# Altium project Coral_Dev_Baseboard.PrjPcb (part 3 of 5)

## Sheet 05_AUDIO.SchDoc
size A2; ApprovedBy: DNP; CheckedBy: DNP; Author: DNP; CompanyName: Google LLC; DrawnBy: DNP; Engineer: Bangfei/Michael/Leo; Organization: Google LLC; Address1: 1600 Amphitheatre Parkway; Address2: Mountain View, CA 94043; Address3: DNP; Address4: DNP; DocumentNumber: DNP; Revision: PVT; SheetNumber: 5; SheetTotal: 11; VersionControl_RevNumber: DNP; IsUserConfigurable: DNP; Time: DNP; ImagePath: DNP; Rule: DNP; ProjectName: Enterprise; Application_BuildNumber: DNP
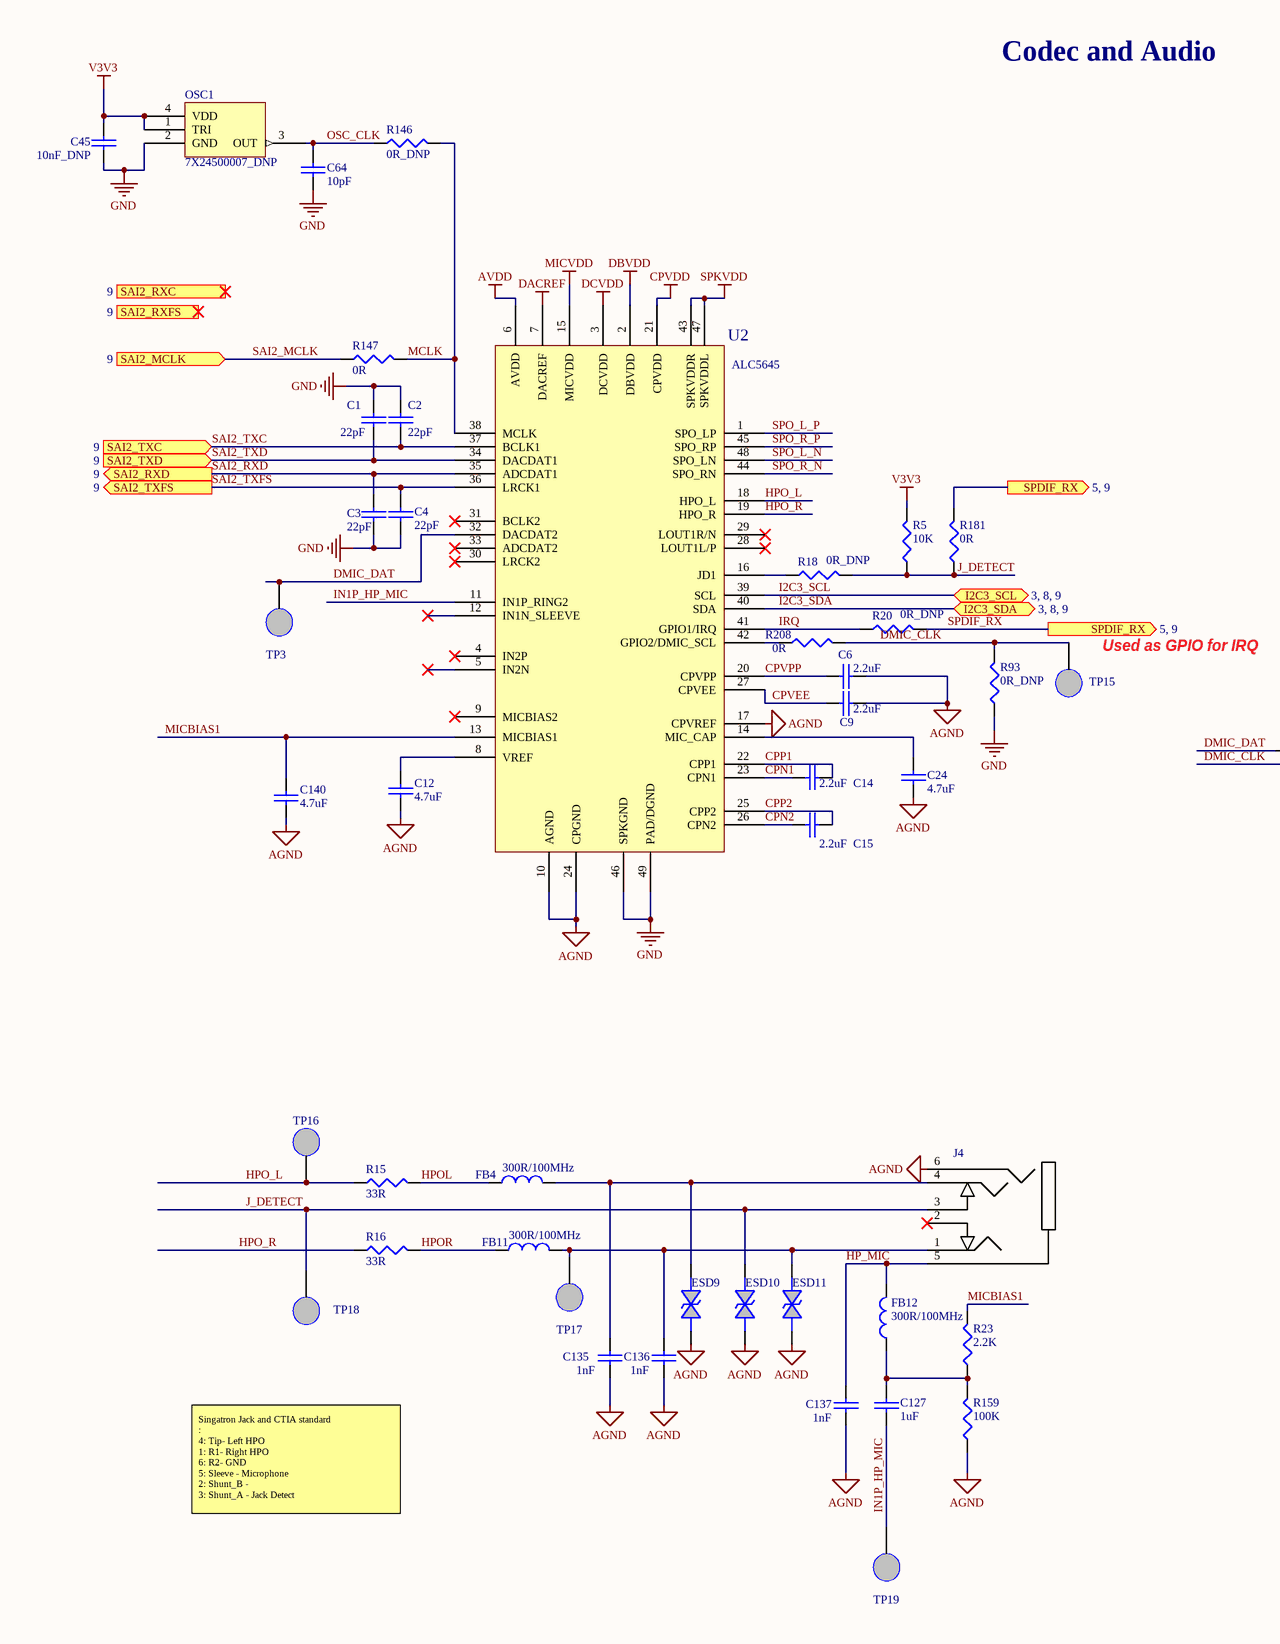
[diagram p6: 05_AUDIO.SchDoc, left]
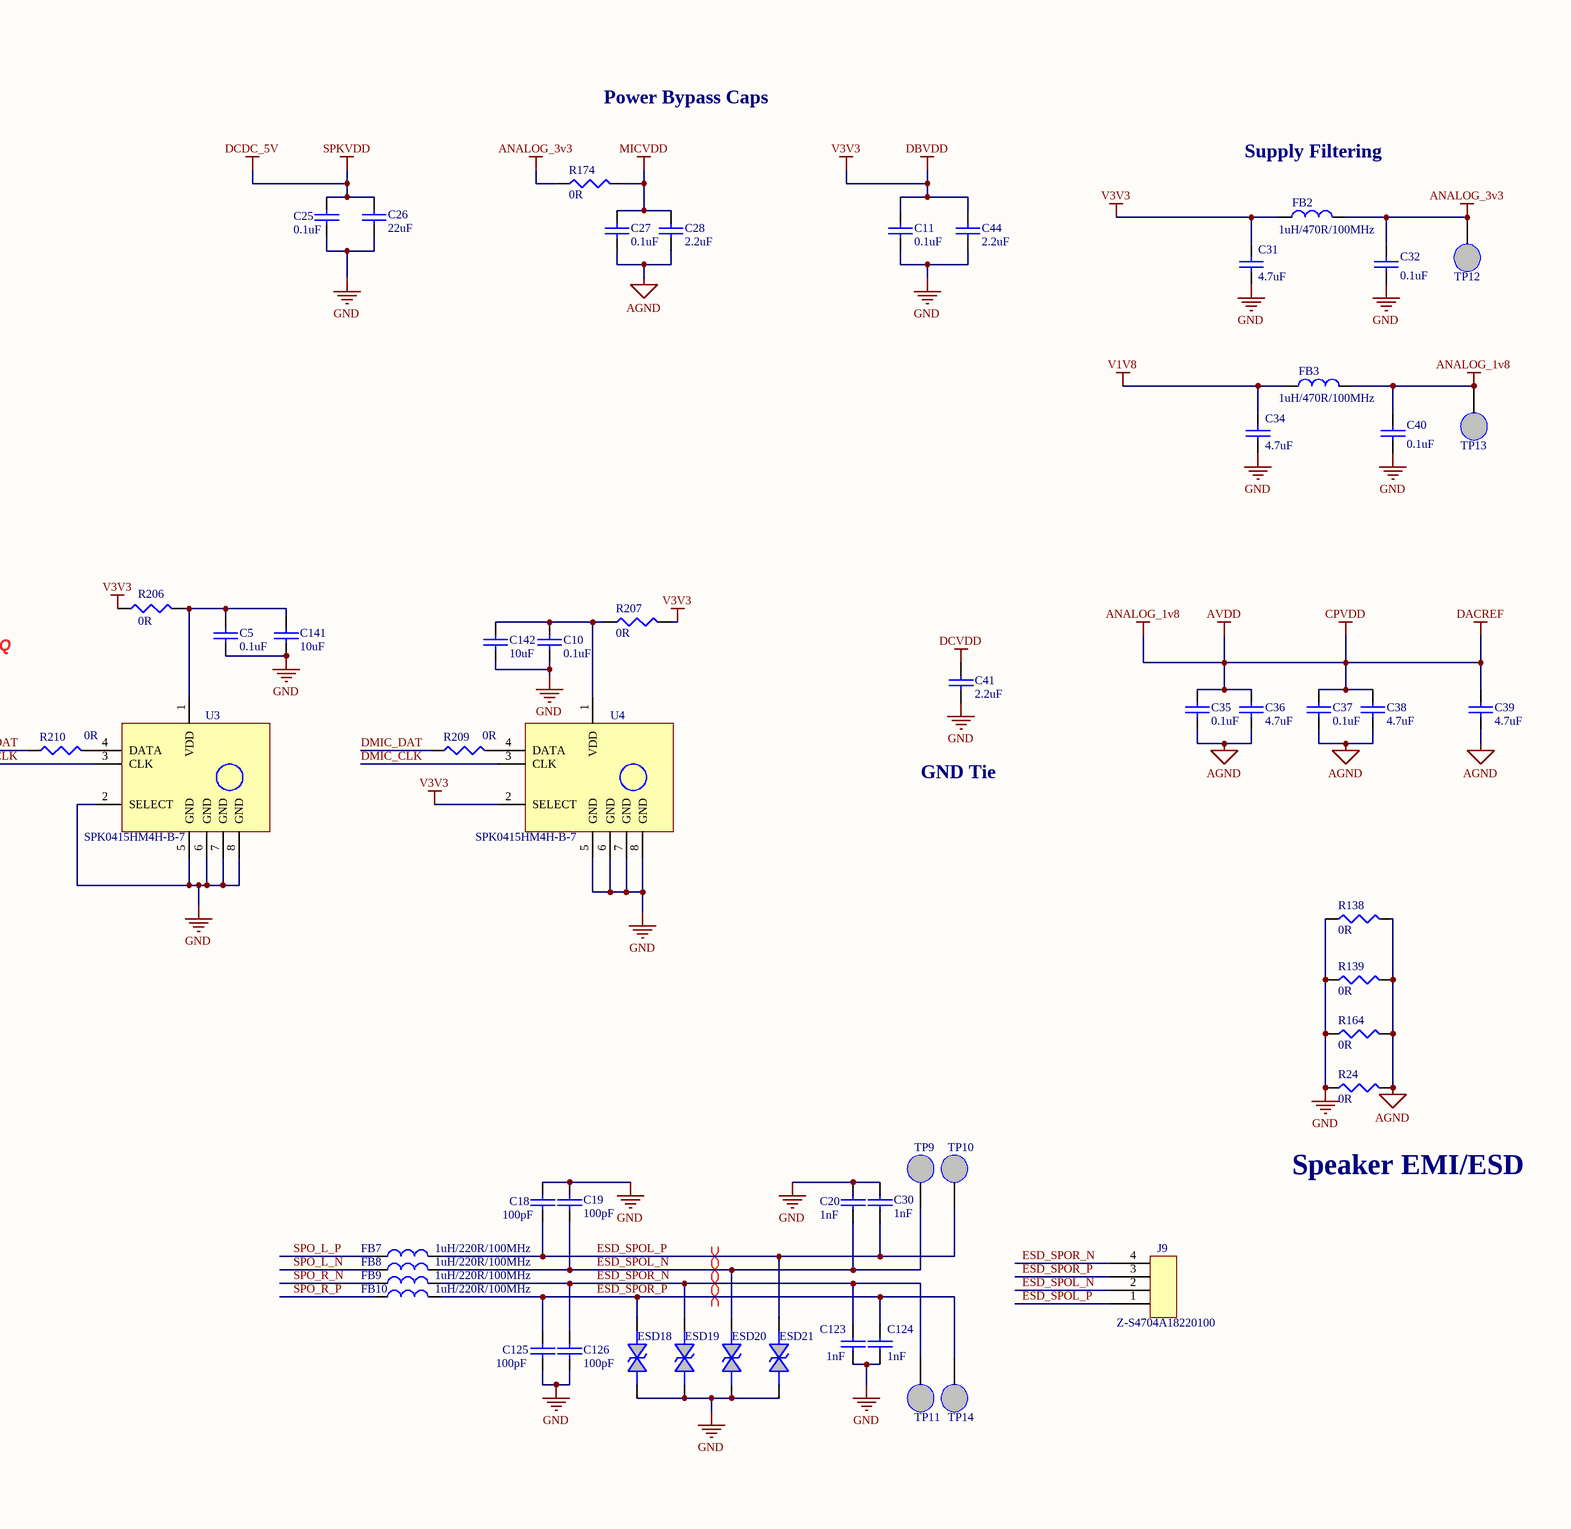
[diagram p7: 05_AUDIO.SchDoc, right]

### Parts
C1  value 22pF  [0201]  (hidden comment: 22pF/6.3V)
C2  value 22pF  [0201]  (hidden comment: 22pF/6.3V)
C3  value 22pF  [0201]  (hidden comment: 22pF/6.3V)
C4  value 22pF  [0201]  (hidden comment: 22pF/6.3V)
C5  value 0.1uF  [0201]  (hidden comment: 0.1uF/10V)
C6  value 2.2uF  [0201]  (hidden comment: 2.2uF/6.3V)
C9  value 2.2uF  [0201]  (hidden comment: 2.2uF/6.3V)
C10  value 0.1uF  [0201]  (hidden comment: 0.1uF/10V)
C11  value 0.1uF  [0201]  (hidden comment: 0.1uF/10V)
C12  value 4.7uF  [0402]  (hidden comment: 4.7uF/10V)
C14  value 2.2uF  [0201]  (hidden comment: 2.2uF/6.3V)
C15  value 2.2uF  [0201]  (hidden comment: 2.2uF/6.3V)
C18  value 100pF  [0201]  (hidden comment: 100pF/25V)
C19  value 100pF  [0201]  (hidden comment: 100pF/25V)
C20  value 1nF  [0201]  (hidden comment: 1nF/25V)
C24  value 4.7uF  [0402]  (hidden comment: 4.7uF/10V)
C25  value 0.1uF  [0402]  (hidden comment: 0.1uF/16V)
C26  value 22uF  [0603]  (hidden comment: 10uF/10V)
C27  value 0.1uF  [0201]  (hidden comment: 0.1uF/10V)
C28  value 2.2uF  [0201]  (hidden comment: 2.2uF/6.3V)
C30  value 1nF  [0201]  (hidden comment: 1nF/25V)
C31  value 4.7uF  [0402]  (hidden comment: 4.7uF/10V)
C32  value 0.1uF  [0603]  (hidden comment: 0.1uF/10V)
C34  value 4.7uF  [0402]  (hidden comment: 4.7uF/10V)
C35  value 0.1uF  [0201]  (hidden comment: 0.1uF/10V)
C36  value 4.7uF  [0402]  (hidden comment: 4.7uF/10V)
C37  value 0.1uF  [0201]  (hidden comment: 0.1uF/10V)
C38  value 4.7uF  [0402]  (hidden comment: 4.7uF/10V)
C39  value 4.7uF  [0402]  (hidden comment: 4.7uF/10V)
C40  value 0.1uF  [0402]  (hidden comment: 0.1uF/16V)
C41  value 2.2uF  [0201]  (hidden comment: 2.2uF/6.3V)
C44  value 2.2uF  [0201]  (hidden comment: 2.2uF/6.3V)
C45  10nF_DNP  [0201]
C64  value 10pF  [0201]  (hidden comment: 10pF/25V)
C123  value 1nF  [0201]  (hidden comment: 1nF/25V)
C124  value 1nF  [0201]  (hidden comment: 1nF/25V)
C125  value 100pF  [0201]  (hidden comment: 100pF/25V)
C126  value 100pF  [0201]  (hidden comment: 100pF/25V)
C127  value 1uF  [0402]  (hidden comment: 1uF/6.3V)
C135  value 1nF  [0201]  (hidden comment: 1nF/25V)
C136  value 1nF  [0201]  (hidden comment: 1nF/25V)
C137  value 1nF  [0201]  (hidden comment: 1nF/25V)
C140  value 4.7uF  [0402]  (hidden comment: 4.7uF/10V)
C141  value 10uF  [0402]  (hidden comment: 10uF/10V)
C142  value 10uF  [0402]  (hidden comment: 10uF/10V)
ESD9  3.5pF/5V  [0201]  (value not drawn)
ESD10  3.5pF/5V  [0201]  (value not drawn)
ESD11  3.5pF/5V  [0201]  (value not drawn)
ESD18  3.5pF/5V  [0201]  (value not drawn)
ESD19  3.5pF/5V  [0201]  (value not drawn)
ESD20  3.5pF/5V  [0201]  (value not drawn)
ESD21  3.5pF/5V  [0201]  (value not drawn)
FB2  1uH/470R/100MHz  [0603]
FB3  1uH/470R/100MHz  [0603]
FB4  300R/100MHz  [0402]
FB7  1uH/220R/100MHz  [0603]
FB8  1uH/220R/100MHz  [0603]
FB9  1uH/220R/100MHz  [0603]
FB10  1uH/220R/100MHz  [0603]
FB11  300R/100MHz  [0402]
FB12  300R/100MHz  [0402]
J4  CONN_2SJ2296-000111  [AUDIO-2SJ2296-000111]  (value not drawn)
J9  Z-S4704A18220100  [SIP4-2_54-S4704A18220100]
OSC1  7X24500007_DNP  [4-SMD-OSC]
R5  10K  [0201]
R15  33R  [0402]
R16  33R  [0402]
R18  0R_DNP  [0201]
R20  0R_DNP  [0201]
R23  2.2K  [0201]
R24  0R  [0201]
R93  0R_DNP  [0201]
R138  0R  [0201]
R139  0R  [0201]
R146  0R_DNP  [0201]
R147  0R  [0201]
R159  100K  [0402]
R164  0R  [0201]
R174  0R  [0402]
R181  0R  [0201]
R206  0R  [0201]
R207  0R  [0201]
R208  0R  [0201]
R209  0R  [0201]
R210  0R  [0201]
TP3  TP NM  [TP_SMD]  (value not drawn)  (no BOM)
TP9  TP NM  [TP_SMD]  (value not drawn)  (no BOM)
TP10  TP NM  [TP_SMD]  (value not drawn)  (no BOM)
TP11  TP NM  [TP_SMD]  (value not drawn)  (no BOM)
TP12  TP NM  [TP_SMD]  (value not drawn)  (no BOM)
TP13  TP NM  [TP_SMD]  (value not drawn)  (no BOM)
TP14  TP NM  [TP_SMD]  (value not drawn)  (no BOM)
TP15  TP NM  [TP_SMD]  (value not drawn)  (no BOM)
TP16  TP NM  [TP_SMD]  (value not drawn)  (no BOM)
TP17  TP NM  [TP_SMD]  (value not drawn)  (no BOM)
TP18  TP NM  [TP_SMD]  (value not drawn)  (no BOM)
TP19  TP NM  [TP_SMD]  (value not drawn)  (no BOM)
U2  ALC5645  [CODEC_ALC5645]
U3  SPK0415HM4H-B-7  [Microphone_SPK0415HM4H-B-7]
U4  SPK0415HM4H-B-7  [Microphone_SPK0415HM4H-B-7]

### Ports
I2C3_SCL (bidir, see 3, 8, 9), I2C3_SDA (bidir, see 3, 8, 9), SAI2_MCLK (in, see 9), SAI2_RXC (in, see 9), SAI2_RXD (out, see 9), SAI2_RXFS (in, see 9), SAI2_TXC (in, see 9), SAI2_TXD (in, see 9), SAI2_TXFS (out, see 9), SPDIF_RX (out, see 5, 9)

### Nets
AGND: C6.2 C9.2 C12.2 C24.1 C27.2 C28.2 C35.2 C36.2 C37.2 C38.2 C39.2 C135.1 C136.1 C137.1 C140.2 ESD9.1 ESD10.1 ESD11.1 J4.6(RING_B) R24.2 R138.2 R139.2 R159.1 R164.2 U2.10(AGND) U2.17(CPVREF) U2.24(CPGND)
ANALOG_1v8: C35.1 C36.1 C37.1 C38.1 C39.1 C40.1 FB3.2 TP13.1 U2.6(AVDD) U2.7(DACREF) U2.21(CPVDD)  [also labelled AVDD, CPVDD, DACREF]
ANALOG_3v3: C32.1 FB2.2 R174.1 TP12.1
DBVDD: C11.1 C31.1 C44.1 C45.1 FB2.1 OSC1.1(TRI) OSC1.4(VDD) R5.2 R206.1 R207.2 U2.2(DBVDD) U4.2(SELECT)  [also labelled V3V3]  [project net BB_3V3]
DCDC_5V: C25.1 C26.1 U2.43(SPKVDDR) U2.47(SPKVDDL)  [also labelled SPKVDD]
DCVDD: C41.1 U2.3(DCVDD)
GND: C1.1 C2.1 C3.2 C4.2 C5.2 C10.2 C11.2 C18.1 C19.1 C20.2 C25.2 C26.2 C30.2 C31.2 C32.2 C34.2 C40.2 C41.2 C44.2 C45.2 C64.2 C123.1 C124.1 C125.2 C126.2 C141.2 C142.2 ESD18.1 ESD19.1 ESD20.1 ESD21.1 OSC1.2(GND) R24.1 R93.1 R138.1 R139.1 R164.1 U2.46(SPKGND) U2.49(PAD/DGND) U3.2(SELECT) U3.5(GND) U3.6(GND) U3.7(GND) U3.8(GND) U4.5(GND) U4.6(GND) U4.7(GND) U4.8(GND)
MICVDD: C27.1 C28.1 R174.2 U2.15(MICVDD)
V1V8: C34.1 FB3.1  [project net BB_1V8]
CPN1: C14.1 U2.23(CPN1)
CPN2: C15.1 U2.26(CPN2)
CPP1: C14.2 U2.22(CPP1)
CPP2: C15.2 U2.25(CPP2)
CPVEE: C9.1 U2.27(CPVEE)
CPVPP: C6.1 U2.20(CPVPP)
DMIC_CLK: R93.2 R208.2 TP15.1 U3.3(CLK) U4.3(CLK)
DMIC_DAT: R209.1 R210.1 TP3.1 U2.32(DACDAT2)
ESD_SPOL_N: C19.2 C20.1 ESD20.2 FB8.2 J9.2 TP9.1
ESD_SPOL_P: C18.2 C30.1 ESD21.2 FB7.2 J9.1 TP10.1
ESD_SPOR_N: C123.2 C126.1 ESD19.2 FB9.2 J9.4 TP11.1
ESD_SPOR_P: C124.2 C125.1 ESD18.2 FB10.2 J9.3 TP14.1
HP_MIC: C137.2 FB12.2 J4.5(SLEEVE)
HPO_L: R15.1 TP16.1 U2.18(HPO_L)
HPO_R: R16.1 U2.19(HPO_R)
HPOL: FB4.1 R15.2
HPOR: FB11.1 R16.2
I2C3_SCL: U2.39(SCL) ; port I2C3_SCL
I2C3_SDA: U2.40(SDA) ; port I2C3_SDA
IN1P_HP_MIC: C127.2 TP19.1 U2.11(IN1P_RING2)
IRQ: R20.1 U2.41(GPIO1/IRQ)
J_DETECT: ESD10.2 J4.3(SHUNT_A) R5.1 R18.2 R181.1 TP18.1
MCLK: R146.2 R147.2 U2.38(MCLK)
MICBIAS1: C140.1 R23.2 U2.13(MICBIAS1)
OSC_CLK: C64.1 OSC1.3(OUT) R146.1
SAI2_MCLK: R147.1 ; port SAI2_MCLK
SAI2_RXD: C3.1 U2.35(ADCDAT1) ; port SAI2_RXD
SAI2_TXC: C2.2 U2.37(BCLK1) ; port SAI2_TXC
SAI2_TXD: C1.2 U2.34(DACDAT1) ; port SAI2_TXD
SAI2_TXFS: C4.1 U2.36(LRCK1) ; port SAI2_TXFS
SPDIF_RX: R20.2 R181.2 ; port SPDIF_RX
SPO_L_N: FB8.1 U2.48(SPO_LN)
SPO_L_P: FB7.1 U2.1(SPO_LP)
SPO_R_N: FB9.1 U2.44(SPO_RN)
SPO_R_P: FB10.1 U2.45(SPO_RP)
NetC5_1: C5.1 C141.1 R206.2 U3.1(VDD)
NetC10_1: C10.1 C142.1 R207.1 U4.1(VDD)
NetC12_1: C12.1 U2.8(VREF)
NetC24_2: C24.2 U2.14(MIC_CAP)
NetC127_1: C127.1 FB12.1 R23.1 R159.2
NetC135_2: C135.2 ESD9.2 FB4.2 J4.4(TIP_SPRING)
NetC136_2: C136.2 ESD11.2 FB11.2 J4.1(RING_A) TP17.1
NetR18_1: R18.1 U2.16(JD1)
NetR208_1: R208.1 U2.42(GPIO2/DMIC_SCL)
NetR209_2: R209.2 U4.4(DATA)
NetR210_2: R210.2 U3.4(DATA)

Not connected (* = marked no-connect by the designer): J4 2(SHUNT_B)*; U2 4(IN2P)* 5(IN2N)* 9(MICBIAS2)* 12(IN1N_SLEEVE)* 28(LOUT1L/P)* 29(LOUT1R/N)* 30(LRCK2)* 31(BCLK2)* 33(ADCDAT2)*

### Layout directives
differential pair: ESD_SPOL_N, ESD_SPOL_P, ESD_SPOR_N, ESD_SPOR_P

### Notes on the sheet
- Codec and Audio
- Power Bypass Caps
- Supply Filtering
- (near TP15) Used as GPIO for IRQ
- GND Tie
- Speaker EMI/ESD
- Singatron Jack and CTIA standard
  :
  4: Tip- Left HPO
  1: R1- Right HPO
  6: R2- GND
  5: Sleeve - Microphone
  2: Shunt_B -
  3: Shunt_A - Jack Detect
  Shunt A (pin #3) is normally closed with pin #4; Shunt B (pin #2) is normally closed with pin #1.
  When plug inserted, Shunt A (pin #3) is open from pin # 4 & Shunt B (pin #2) is open from pin #1.
- Project:
- Engineer:
- Date:
- File:
- Revision:
- Sheet
- of

### Library data of the parts
C1-C4 = CAP_0201_22pF: CAP CER 22pF 6.3V 2% C0G NP0 0201; MPN: GJM0335C0J220GB01D; QCI MPN: GRM0335C1H220G; QPN: CH0226G0E00; QPN Description: CAP CHIP 22PF 50V(+-2%,COG,0201); Function Code: ADO; Supplier 1: Digi-Key; Supplier Part Number 1: 490-6067-2-ND; QCI Supplier: MUR
C5 C10 C11 C27 C35 C37 = CAP_0201_0.1uF: CAP CER 0.1UF 10V 10% X5R 0201; MPN: C0603X5R1A104K030BC; QCI MPN: GRM033R61A104K; QPN: CH4102K9E00; QPN Description: CAP CHIP 0.1U 10V(+-10%,X5R,0201); Function Code: ADO; Supplier 1: Digi-Key; Supplier Part Number 1: 445-7318-1-ND; QCI Supplier: MUR
C6 C9 C14 C15 C28 C41 C44 = CAP_0201_2.2uF: CAP CER 2.2uF 6.3V 20% X5R 0201; MPN: GRM033R60J225ME15D; QCI MPN: GRM033R60J225M; QPN: CH5221M9E00; QPN Description: CAP CHIP 2.2UF 6.3V(+-20%,X5R,0201); Function Code: ADO; Supplier 1: Digi-Key; Supplier Part Number 1: 490-13224-2-ND; QCI Supplier: MUR
C12 C24 C36 C38 C39 C140 = CAP_0201_4.7uF: CAP CER 4.7UF 10V 20% X5R 0402; MPN: C1005X5R1A475M050BC; QCI MPN: GRM155R61A475M; QPN: CH5472M9B01; QPN Description: CAP CHIP 4.7U 10V(+-20%,X5R,0402); Function Code: ADO; Supplier 1: Digi-Key; Supplier Part Number 1: 445-8023-1-ND; QCI Supplier: MUR
C18 C19 C125 C126 = CAP_0201_100pF: CAP CER 100PF 25V X7R 0201; MPN: GRM033R71E101KA01D; QCI MPN: GRM033R71E101K; QPN: CH1104K1E01; QPN Description: CAP CHIP 100PF 25V(+-10%,X7R,0201); Function Code: SPK; Supplier 1: Digi-Key; Supplier Part Number 1: 490-3172-1-ND; QCI Supplier: MUR
C20 C30 C123 C124 = CAP_0201_1.0nF: CAP CER 1nF 25V 10% X7R 0201; MPN: GRM033R71E102KA01D; QCI MPN: GRM033R71E102K; QPN: CH2104K1E00; QPN Description: CAP CHIP 1000P 25V(+-10%,X7R,0201); Function Code: SPK; Supplier 1: Digi-Key; Supplier Part Number 1: 490-3184-2-ND; QCI Supplier: MUR
C25 C40 = CAP_0402_0.1uF: CAP CER 0.1uF 16V 10% X7R 0402; MPN: C0402C104K4RACTU; QCI MPN: GRM155R71C104K; QPN: CH4103K1B18; QPN Description: CAP CHIP 0.1U 16V(10%,X7R,0402); Function Code: ADO; Supplier 1: Digi-Key; Supplier Part Number 1: 399-3521-1-ND; QCI Supplier: MUR
C26 = CAP_0603_22uF: CAP CER 22UF 6.3V 10% X5R 0603; MPN: CL10A226KQ8NRNE; QCI MPN: GRM188R61A106M; QPN: CH6102M9900; QPN Description: CAP CHIP 10U 10V(+-20%,X5R,0603); Function Code: USB; Supplier 1: Digi-Key; Supplier Part Number 1: 1276-2867-2-ND; QCI Supplier: MUR
C31 C34 = CAP_0402_4.7uF: CAP CER 4.7UF 10V 20% X5R 0402; MPN: C1005X5R1A475M050BC; QCI MPN: GRM155R61A475M; QPN: CH5472M9B01; QPN Description: CAP CHIP 4.7U 10V(+-20%,X5R,0402); Function Code: ADO; Supplier 1: Digi-Key; Supplier Part Number 1: 445-8023-1-ND; QCI Supplier: MUR
C32 = CAP_0603_0.1uF: CAP CER 0.1UF 10V 10% X5R 0603; MPN: GRM188R71C104M; QCI MPN: 0603B104K100CT; QPN: CH4102K1900; QPN Description: CAP CHIP 0.1UF 10V(+-10%,X7R,0603); Function Code: ADO; Supplier 1: Digi-Key; Supplier Part Number 1: 490-1519-1-ND; QCI Supplier: WTC
C45 = CAP_0201_10nF: CAP CER 0.01UF 10V 10% X5R 0201; MPN: GRM033R61A103KA01D; QCI MPN: GRM033R71A103K; DNP: V; QPN: CH3102K1E01; QPN Description: CAP CHIP 0.01UF 10V(10%,X7R,0201); Function Code: ADO; Supplier 1: Digi-Key; Value: 10nF_DNP; Supplier Part Number 1: 490-3166-1-ND; QCI Supplier: MUR
C64 = CAP_0201_10pF_HF: CAP CER 10PF 25V 5% C0H 0201; MPN: GJM0336C1E100JB01D; QCI MPN: GRM0335C1E100J; QPN: CH0104J0E05; QPN Description: CAP CHIP 10P 25V(+-5%,COG,0201); Function Code: ADO; Supplier 1: Digi-Key; Supplier Part Number 1: 490-11187-1-ND; QCI Supplier: MUR
C127 = CAP_0402_1.0uF: CAP CER 1.0UF 6.3V 10% X5R 0402; MPN: C0603X5R0J105M030BC; QCI MPN: GRM155R70J105K; QPN: CH5101K1B01; QPN Description: CAP CHIP 1U,6.3V(+-10%,X7R,0402); Function Code: AMJ; Supplier 1: Digi-Key; Supplier Part Number 1: 399-4873-1-ND; QCI Supplier: MUR
C135-C137 = CAP_0201_1.0nF: CAP CER 1nF 25V 10% X7R 0201; MPN: GRM033R71E102KA01D; QCI MPN: GRM033R71E102K; QPN: CH2104K1E00; QPN Description: CAP CHIP 1000P 25V(+-10%,X7R,0201); Function Code: AMJ; Supplier 1: Digi-Key; Supplier Part Number 1: 490-3184-2-ND; QCI Supplier: MUR
C141 C142 = CAP_0402_10uF: CAP CER 10UF 10V 20% X5R 0402; MPN: CL05A106MP5NUNC; QCI MPN: GRM155R61A106M; QPN: CH6102M9B00; QPN Description: CAP CHIP 10U 10V (+-20%, X5R, 0402)'; Function Code: LAN; Supplier 1: Digi-Key; Supplier Part Number 1: 1276-1450-1-ND; QCI Supplier: MUR
ESD9-ESD11 = DIODE BI-DIR TRIG: DIODE TVS 15kV 10V 50A 8pF SMT RoHS; MPN: DESD5V0V1BCSP-7; QPN: BC5V0V1BZ02; QPN Description: DIODE ESD SMD DESD5V0V1BCSP-7 6V,DSN0603; Function Code: AMJ; QCI MPN: DESD5V0V1BCSP-7; QCI Supplier: DDS
ESD18-ESD21 = DIODE BI-DIR TRIG: DIODE TVS 15kV 10V 50A 8pF SMT RoHS; MPN: DESD5V0V1BCSP-7; QPN: BC5V0V1BZ02; QPN Description: DIODE ESD SMD DESD5V0V1BCSP-7 6V,DSN0603; Function Code: SPK; QCI MPN: DESD5V0V1BCSP-7; QCI Supplier: DDS
FB2 FB3 = INDUCTOR_BLM18PG471SN1: FERRITE CHIP 470 OHM 1.0A 0603; QCI MPN: BLM18PG471SN1D; QPN: CX8PG471000; QPN Description: EMI FILTER BLM18PG471SN1D(470,1000MA); Function Code: ADO; Supplier 1: Digi-Key; Supplier Part Number 1: 445-5222-2-ND; Value: 1uH/470R/100MHz; QCI Supplier: MUR; MPN: BLM18PG471SN1
FB4 FB11 FB12 = INDUCTOR_BLM18EG221SN1D: EMI FILTER FCM1005KF-301T03 (300,300MA); Value: 1uH; QPN: CX301T03000; Function Code: AMJ; Supplier 1: Digi-Key; Supplier Part Number 1: 490-3992-1-ND; QCI Supplier: TTA; MPN: FCM1005KF-301T03; QCI MPN: FCM1005KF-301T03; QPN Description: EMI FILTER FCM1005KF-301T03 (300,300MA)
FB7-FB10 = INDUCTOR_BLM18EG221SN1D: FERRITE CHIP 220 OHM 2.0A 0603; Value: 1uH; QPN: CX8EG221011; QPN Description: EMI FILTER BLM18EG221SN1D(220,2A); Function Code: SPK; Supplier 1: Digi-Key; Supplier Part Number 1: 490-3992-1-ND; QCI Supplier: MUR; MPN: BLM18EG221SN1D; QCI MPN: BLM18EG221SN1D
J4 = CONN_2SJ2296-000111: CONN AUDIO JACK 3.5MM 6COND SMD; QPN: DFTJ06FR320; QPN Description: CONN SMD PHONE JACK 6P FR(H4.5); Function Code: AMJ; MPN: 2SJ2296-000111; QCI MPN: 2SJ2296-000111; QCI Supplier: SIT
J9 = CONN_TERMINAL_4POS_PHOENIX: CONN TERM BLOCK 2.54MM 4POS PCB; QPN: DFHS04FR969; QPN Description: CONN DIP HOUSING 4P 1R FR(P2.54,H8.5); Function Code: SPK; Supplier 1: Digi-Key; MPN: Z-S4704A18220100; QCI MPN: Z-S4704A18220100; QCI Supplier: NEX
OSC1 = OSC_7X24500007: 24.576MHz SINE Oscillator Surface Mount 3.3V 13mA Enable/Disable; DNP: V; Function Code: ADO; MPN: 7X24500007_DNP
R5 = R_0201_10K: RES SMD 10K OHM JUMPER 1/20W  0201; MPN: ERJ-1GEF103C; QCI MPN: RC0201JR-1310KL; QPN: CS31001JE16; QPN Description: RES CHIP 10K 1/20W +-5%(0201); Function Code: ADO; Supplier 1: Digi-Key; VALUE: 10K; Supplier Part Number 1: P10.0KABCT-ND; QCI Supplier: YGO
R15 R16 = R_0402_33: RES SMD 33 OHM 1% 1/10W 0402; MPN: RC0402FR-0733R; QPN: CS03302FB01; QPN Description: RES CHIP 33 1/16W +-1%(0402); Function Code: AMJ; Supplier 1: Digi-Key; Supplier Part Number 1: P33.0LTR-ND; VALUE: 33R; QCI Supplier: YGO; QCI MPN: RC0402FR-0733R
R18 R20 R93 R146 = R_0201_0: RES SMD 0.0OHM JUMPER 1/20W 0201; MPN: ERJ-1GN0R00C; QCI MPN: RC0201JR-130RL; DNP: V; QPN: CS00001JE18; QPN Description: RES CHIP 0(1/20W,+-5%,0201); Function Code: ADO; Supplier 1: Digi-Key; Supplier Part Number 1: P15979CT-ND; VALUE: 0R_DNP; QCI Supplier: YGO
R23 = R_0201_2.2K: RES SMD 2.2K OHM 1% 1/20W 0201; MPN: ERJ-1GEF2201C; QCI MPN: RC0201FR-072K2L; QPN: CS22201FE04; QPN Description: RES CHIP 2.2K 1/20W +-1%(0201); Function Code: AMJ; Supplier 1: Digi-Key; Supplier Part Number 1: P2.20KABCT-ND; VALUE: 2.2K; QCI Supplier: YGO
R24 R138 R139 R164 R206-R210 = R_0805_0: RES SMD 0.0OHM JUMPER 1/20W 0201; MPN: ERJ-1GN0R00C; QCI MPN: RC0201JR-130RL; QPN: CS00001JE18; QPN Description: RES CHIP 0(1/20W,+-5%,0201); Function Code: SPK; Supplier 1: Digi-Key; Supplier Part Number 1: P15979CT-ND; Value: 0R; QCI Supplier: YGO
R147 R181 = R_0201_0: RES SMD 0.0OHM JUMPER 1/20W 0201; MPN: ERJ-1GN0R00C; QCI MPN: RC0201JR-130RL; QPN: CS00001JE18; QPN Description: RES CHIP 0(1/20W,+-5%,0201); Function Code: ADO; Supplier 1: Digi-Key; Supplier Part Number 1: P15979CT-ND; VALUE: 0R; QCI Supplier: YGO
R159 = R_0402_1.6k: RES CHIP 100K 1/16W 5%(0402); MPN: YAG3045TR-ND; QCI MPN: RC0402JR-7D100KL; QPN: CS41002JB20; Function Code: AMJ; Supplier 1: Digi-Key; Supplier Part Number 1: YAG3045TR-ND; VALUE: 100K; QCI Supplier: YGO; QPN Description: RES CHIP 100K 1/16W 5%(0402)
R174 = R_0402_0: RES SMD 0.0 OHM JUMPER 1/10W  0402; MPN: ERJ-2GE0R00X; QCI MPN: RC0402FR-070RL; QPN: CS00002FB00; QPN Description: RES CHIP 0 1/16W +-1%(0402); Function Code: DBG; Supplier 1: Digi-Key; Supplier Part Number 1: P0.0JCT-ND; VALUE: 0R; QCI Supplier: YGO
TP3 TP9-TP19 = TP: TEST POIN
U2 = ALC5645: Multi-Channel Audio Hub/CODEC and SounzReal Digital Sound Effect; QCI MPN: ALC5645-CGT; QPN: AL005645000; QPN Description: IC OTHER(48P) ALC5645-CGT(QFN); Function Code: ADO; MPN: ALC5645; QCI Supplier: RSC
U3 U4 = Microphone_SPK0415HM4H-B-7: Microphone MEMS, Digital PDM OMNI -26dB; QPN: DN0415HM000; QPN Description: MICPHONE SPK0415HM4H-B-7; Function Code: ADO; Supplier 1: Digikey; MPN: SPK0415HM4H-B-7; QCI MPN: SPK0415HM4H-B-7; QCI Supplier: EIP

## Sheet 06_GBE_SDCARD.SchDoc
size A2; ApprovedBy: DNP; CheckedBy: DNP; Author: DNP; CompanyName: Google LLC; DrawnBy: DNP; Engineer: Bangfei/Michael/Leo; Organization: Google LLC; Address1: 1600 Amphitheatre Parkway; Address2: Mountain View, CA 94043; Address3: DNP; Address4: DNP; DocumentNumber: DNP; Revision: PVT; SheetNumber: 6; SheetTotal: 11; VersionControl_RevNumber: DNP; IsUserConfigurable: DNP; Time: DNP; ImagePath: DNP; Rule: DNP; ProjectName: Enterprise; Application_BuildNumber: DNP
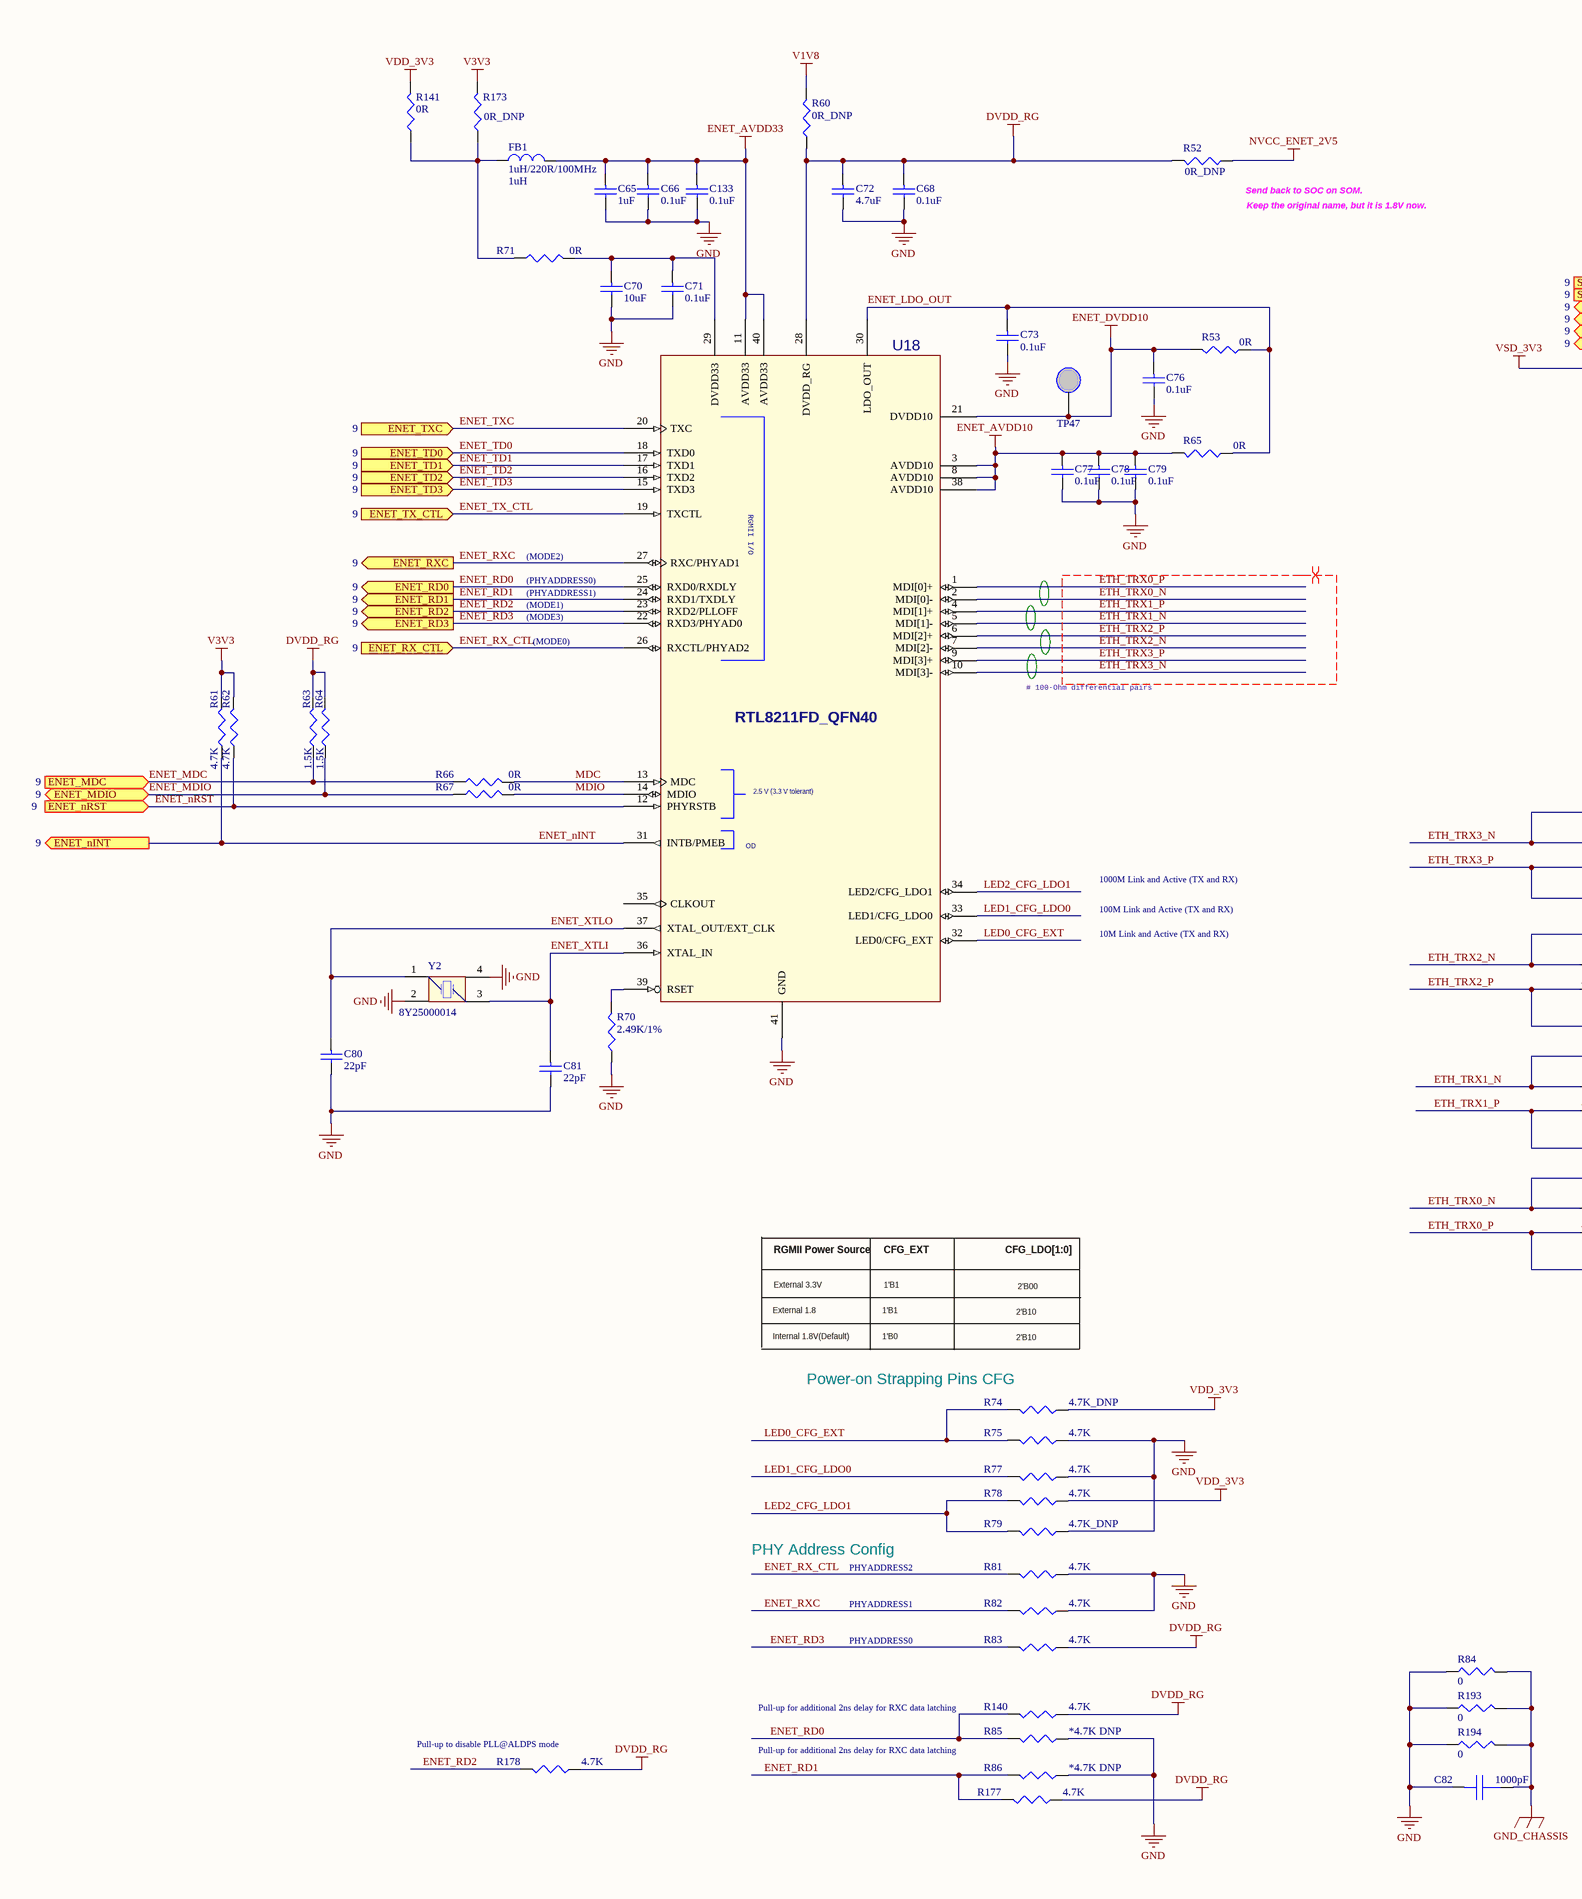
[diagram p8: 06_GBE_SDCARD.SchDoc, left]
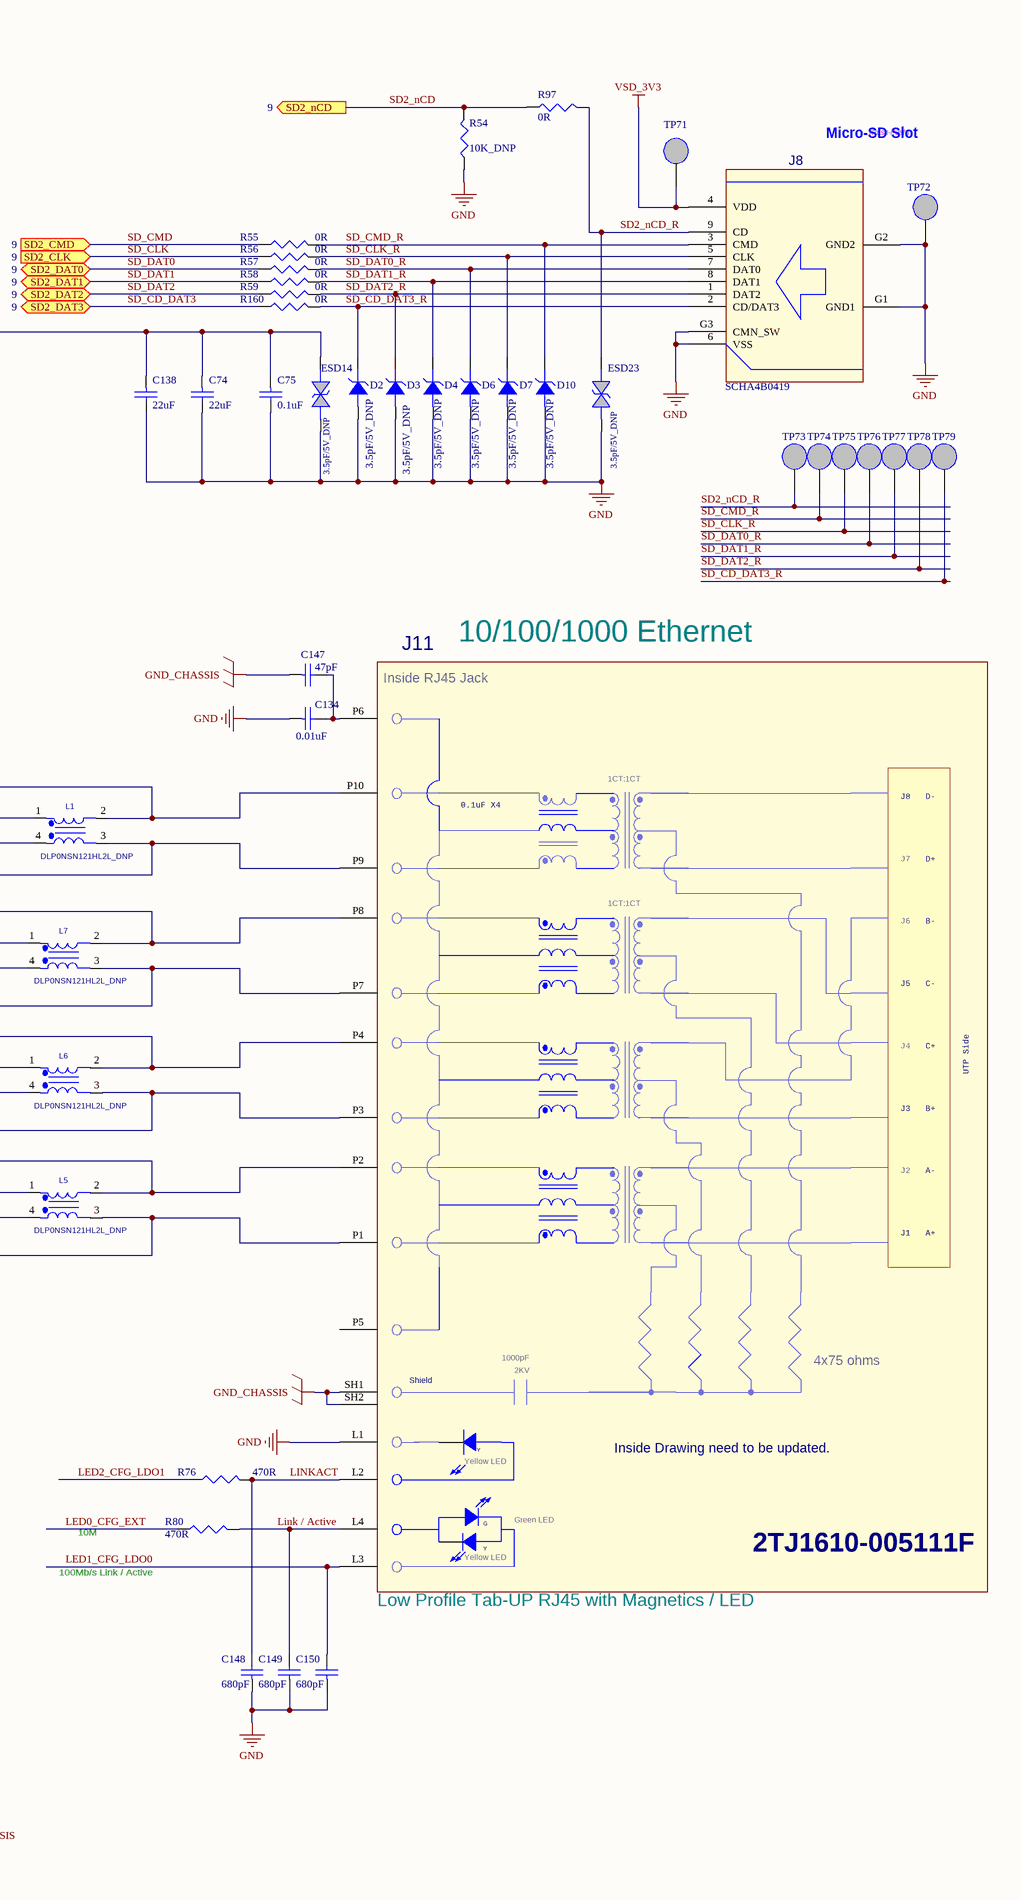
[diagram p9: 06_GBE_SDCARD.SchDoc, right]

### Parts
C65  value 1uF  [0201]  (hidden comment: 1uF/6.3V)
C66  value 0.1uF  [0201]  (hidden comment: 0.1uF/10V)
C68  value 0.1uF  [0201]  (hidden comment: 0.1uF/10V)
C70  value 10uF  [0402]  (hidden comment: 10uF/10V)
C71  value 0.1uF  [0201]  (hidden comment: 0.1uF/10V)
C72  value 4.7uF  [0402]  (hidden comment: 4.7uF/10V)
C73  value 0.1uF  [0201]  (hidden comment: 0.1uF/10V)
C74  value 22uF  [0603]  (hidden comment: 22uF/10V)
C75  value 0.1uF  [0201]  (hidden comment: 0.1uF/10V)
C76  value 0.1uF  [0201]  (hidden comment: 0.1uF/10V)
C77  value 0.1uF  [0201]  (hidden comment: 0.1uF/10V)
C78  value 0.1uF  [0201]  (hidden comment: 0.1uF/10V)
C79  value 0.1uF  [0201]  (hidden comment: 0.1uF/10V)
C80  value 22pF  [0201]  (hidden comment: 22pF/6.3V)
C81  value 22pF  [0201]  (hidden comment: 22pF/6.3V)
C82  value 1000pF  [1206]  (hidden comment: 1000pF/2KV)
C133  value 0.1uF  [0201]  (hidden comment: 0.1uF/10V)
C134  value 0.01uF  [0201]  (hidden comment: 0.01uF/25V)
C138  value 22uF  [0603]  (hidden comment: 22uF/10V)
C147  value 47pF  [0201]  (hidden comment: 47pF/25V)
C148  value 680pF  [0201]  (hidden comment: 680PF 25V)
C149  value 680pF  [0201]  (hidden comment: 680PF 25V)
C150  value 680pF  [0201]  (hidden comment: 680PF 25V)
D2  3.5pF/5V_DNP  [0201-Diode]
D3  3.5pF/5V_DNP  [0201-Diode]
D4  3.5pF/5V_DNP  [0201-Diode]
D6  3.5pF/5V_DNP  [0201-Diode]
D7  3.5pF/5V_DNP  [0201-Diode]
D10  3.5pF/5V_DNP  [0201-Diode]
ESD14  3.5pF/5V_DNP  [0201]
ESD23  3.5pF/5V_DNP  [0201]
FB1  1uH/220R/100MHz  value 1uH  [0603]
J8  SCHA4B0419  [CON9_SDCARD_8PIN_SCHA4B0419]
J11  2TJ1610-005111F  [RJ45-LED-2TJ1610-005111F]
L1  DLP0NSN121HL2L_DNP  [PL4-DLP0NSN121HL2L]
L5  DLP0NSN121HL2L_DNP  [PL4-DLP0NSN121HL2L]
L6  DLP0NSN121HL2L_DNP  [PL4-DLP0NSN121HL2L]
L7  DLP0NSN121HL2L_DNP  [PL4-DLP0NSN121HL2L]
R52  0R_DNP  [0201]
R53  0R  [0201]
R54  value 10K_DNP  [0201]  (hidden comment: 10K)
R55  0R  [0201]
R56  0R  [0201]
R57  0R  [0201]
R58  0R  [0201]
R59  0R  [0201]
R60  0R_DNP  [0201]
R61  4.7K  [0201]
R62  4.7K  [0201]
R63  1.5K  [0201]
R64  1.5K  [0201]
R65  0R  [0201]
R66  0R  [0201]
R67  0R  [0201]
R70  2.49K/1%  [0201]
R71  0R  [0201]
R74  4.7K_DNP  [0201]
R75  4.7K  [0201]
R76  470R  [0201]
R77  4.7K  [0201]
R78  4.7K  [0201]
R79  4.7K_DNP  [0201]
R80  470R  [0201]
R81  4.7K  [0201]
R82  4.7K  [0201]
R83  4.7K  [0201]
R84  value 0  [0805]  (hidden comment: R_0805_0)
R85  value *4.7K DNP  [0201]  (hidden comment: 4.7K)
R86  value *4.7K DNP  [0201]  (hidden comment: 4.7K)
R97  value 0R  [0201]  (hidden comment: 0R_DNP)
R140  value 4.7K  [0201]  (hidden comment: 4.7K_DNP)
R141  0R  [0201]
R160  0R  [0201]
R173  0R_DNP  [0201]
R177  value 4.7K  [0201]  (hidden comment: 4.7K_DNP)
R178  4.7K  [0201]
R193  value 0  [0805]  (hidden comment: R_0805_0)
R194  value 0  [0805]  (hidden comment: R_0805_0)
TP47  TP NM  [TP_SMD]  (value not drawn)  (no BOM)
TP71  TP NM  [TP_SMD]  (value not drawn)  (no BOM)
TP72  TP NM  [TP_SMD]  (value not drawn)  (no BOM)
TP73  TP NM  [TP3050]  (value not drawn)  (no BOM)
TP74  TP NM  [TP3050]  (value not drawn)  (no BOM)
TP75  TP NM  [TP3050]  (value not drawn)  (no BOM)
TP76  TP NM  [TP3050]  (value not drawn)  (no BOM)
TP77  TP NM  [TP3050]  (value not drawn)  (no BOM)
TP78  TP NM  [TP3050]  (value not drawn)  (no BOM)
TP79  TP NM  [TP3050]  (value not drawn)  (no BOM)
U18  RTL8211FD_QFN40  [QFN40-0_4-5X5-H0_9MM]
Y2  8Y25000014  [DFN130P250X50-4N]

### Ports
ENET_MDC (in, see 9), ENET_MDIO (bidir, see 9), ENET_nINT (out, see 9), ENET_nRST (in, see 9), ENET_RD0 (out, see 9), ENET_RD1 (out, see 9), ENET_RD2 (out, see 9), ENET_RD3 (out, see 9), ENET_RX_CTL (in, see 9), ENET_RXC (out, see 9), ENET_TD0 (in, see 9), ENET_TD1 (in, see 9), ENET_TD2 (in, see 9), ENET_TD3 (in, see 9), ENET_TX_CTL (in, see 9), ENET_TXC (in, see 9), SD2_CLK (in, see 9), SD2_CMD (in, see 9), SD2_DAT0 (bidir, see 9), SD2_DAT1 (bidir, see 9), SD2_DAT2 (bidir, see 9), SD2_DAT3 (bidir, see 9), SD2_nCD (out, see 9)

### Nets
DVDD_RG: C68.1 C72.1 R52.2 R60.1 R63.2 R64.2 R83.1 R140.1 R177.1 R178.1 U18.28(DVDD_RG)
ENET_AVDD10: C77.1 C78.1 C79.1 R65.2 U18.3(AVDD10) U18.8(AVDD10) U18.38(AVDD10)
ENET_AVDD33: C65.1 C66.1 C133.1 FB1.2 U18.11(AVDD33) U18.40(AVDD33)
ENET_DVDD10: C76.1 R53.2 TP47.1 U18.21(DVDD10)
GND: C65.2 C66.2 C68.2 C70.2 C71.2 C72.2 C73.2 C74.2 C75.2 C76.2 C77.2 C78.2 C79.2 C80.2 C81.2 C82.1 C133.2 C134.1 C138.2 C148.1 C149.1 C150.1 D2.A D3.A D4.A D6.A D7.A D10.A ESD14.1 ESD23.1 J8.6(VSS) J8.G1(GND1) J8.G2(GND2) J8.G3(CMN_SW) J11.L1 R54.1 R70.1 R75.1 R77.1 R79.1 R81.1 R82.1 R84.1 R85.1 R86.1 R193.1 R194.1 TP72.1 U18.41(GND) Y2.2 Y2.4
GND_CHASSIS: C82.2 C147.1 J11.SH1 J11.SH2 R84.2 R193.2 R194.2
NVCC_ENET_2V5: R52.1
V1V8: R60.2  [project net BB_1V8]
V3V3: R61.2 R62.2 R173.2  [project net BB_3V3]
VDD_3V3: R74.1 R78.1 R141.2
VSD_3V3: C74.1 C75.1 C138.1 ESD14.2 J8.4(VDD) TP71.1
ENET_LDO_OUT: C73.1 R53.1 R65.1 U18.30(LDO_OUT)
ENET_MDC: R63.1 R66.1 ; port ENET_MDC
ENET_MDIO: R64.1 R67.1 ; port ENET_MDIO
ENET_nINT: R61.1 U18.31(INTB/PMEB) ; port ENET_nINT
ENET_nRST: R62.1 U18.12(PHYRSTB) ; port ENET_nRST
ENET_RD0: R85.2 R140.2 U18.25(RXD0/RXDLY) ; port ENET_RD0
ENET_RD1: R86.2 R177.2 U18.24(RXD1/TXDLY) ; port ENET_RD1
ENET_RD2: R178.2 U18.23(RXD2/PLLOFF) ; port ENET_RD2
ENET_RD3: R83.2 U18.22(RXD3/PHYAD0) ; port ENET_RD3
ENET_RX_CTL: R81.2 U18.26(RXCTL/PHYAD2) ; port ENET_RX_CTL
ENET_RXC: R82.2 U18.27(RXC/PHYAD1) ; port ENET_RXC
ENET_TD0: U18.18(TXD0) ; port ENET_TD0
ENET_TD1: U18.17(TXD1) ; port ENET_TD1
ENET_TD2: U18.16(TXD2) ; port ENET_TD2
ENET_TD3: U18.15(TXD3) ; port ENET_TD3
ENET_TX_CTL: U18.19(TXCTL) ; port ENET_TX_CTL
ENET_TXC: U18.20(TXC) ; port ENET_TXC
ENET_XTLI: C81.1 U18.36(XTAL_IN) Y2.3(OSC3)
ENET_XTLO: C80.1 U18.37(XTAL_OUT/EXT_CLK) Y2.1(OSC1)
ETH_TRX0_N: J11.P2 L5.1 L5.2 U18.2(MDI[0]-)
ETH_TRX0_P: J11.P1 L5.3 L5.4 U18.1(MDI[0]+)
ETH_TRX1_N: J11.P4 L6.1 L6.2 U18.5(MDI[1]-)
ETH_TRX1_P: J11.P3 L6.3 L6.4 U18.4(MDI[1]+)
ETH_TRX2_N: J11.P8 L7.1 L7.2 U18.7(MDI[2]-)
ETH_TRX2_P: J11.P7 L7.3 L7.4 U18.6(MDI[2]+)
ETH_TRX3_N: J11.P10 L1.1 L1.2 U18.10(MDI[3]-)
ETH_TRX3_P: J11.P9 L1.3 L1.4 U18.9(MDI[3]+)
LED0_CFG_EXT: R74.2 R75.2 R80.1 U18.32(LED0/CFG_EXT)
LED1_CFG_LDO0: C150.2 J11.L3 R77.2 U18.33(LED1/CFG_LDO0)
LED2_CFG_LDO1: R76.1 R78.2 R79.2 U18.34(LED2/CFG_LDO1)
Link / Active: C149.2 J11.L4 R80.2
LINKACT: C148.2 J11.L2 R76.2
MDC: R66.2 U18.13(MDC)
MDIO: R67.2 U18.14(MDIO)
SD2_nCD: R54.2 R97.2 ; port SD2_nCD
SD2_nCD_R: ESD23.2 J8.9(CD) R97.1 TP73.1
SD_CD_DAT3: R160.1 ; port SD2_DAT3
SD_CD_DAT3_R: D2.K J8.2(CD/DAT3) R160.2 TP79.1
SD_CLK: R56.1 ; port SD2_CLK
SD_CLK_R: D7.K J8.5(CLK) R56.2 TP75.1
SD_CMD: R55.1 ; port SD2_CMD
SD_CMD_R: D10.K J8.3(CMD) R55.2 TP74.1
SD_DAT0: R57.1 ; port SD2_DAT0
SD_DAT0_R: D6.K J8.7(DAT0) R57.2 TP76.1
SD_DAT1: R58.1 ; port SD2_DAT1
SD_DAT1_R: D4.K J8.8(DAT1) R58.2 TP77.1
SD_DAT2: R59.1 ; port SD2_DAT2
SD_DAT2_R: D3.K J8.1(DAT2) R59.2 TP78.1
NetC70_1: C70.1 C71.1 R71.2 U18.29(DVDD33)
NetC134_2: C134.2 C147.2 J11.P6
NetFB1_1: FB1.1 R71.1 R141.1 R173.1
NetR70_2: R70.2 U18.39(RSET)

Not connected (* = marked no-connect by the designer): J11 P5; U18 35(CLKOUT)

### Layout directives
differential pair: ETH_TRX0_N, ETH_TRX0_P, ETH_TRX1_N, ETH_TRX1_P, ETH_TRX2_N, ETH_TRX2_P, ETH_TRX3_N, ETH_TRX3_P

### Notes on the sheet
- (near R52) Send back to SOC on SOM.
- (near R52) Keep the original name, but it is 1.8V now.
- Micro-SD Slot
- (Push-Push)
- (MODE2)
- (PHYADDRESS0)
- (PHYADDRESS1)
- (MODE1)
- (MODE3)
- (MODE0)
- # 100-Ohm differential pairs
- 10/100/1000 Ethernet
- 1000M Link and Active (TX and RX)
- 100M Link and Active (TX and RX)
- 10M Link and Active (TX and RX)
- RGMII Power Source
- CFG_EXT
- CFG_LDO[1:0]
- External 1.8
- External 3.3V
- 1'B1
- 2'B10
- 2'B00
- Internal 1.8V(Default)
- 1'B0
- (near R74) Power-on Strapping Pins CFG
- PHY Address Config
- 10M
- PHYADDRESS2
- PHYADDRESS1
- 100Mb/s Link / Active
- (near J11) Low Profile Tab-UP RJ45 with Magnetics / LED
- PHYADDRESS0
- Pull-up for additional 2ns delay for RXC data latching
- (near R178) Pull-up to disable PLL@ALDPS mode
- Project:
- Engineer:
- Date:
- File:
- Revision:
- Sheet
- of
- (in symbol RJ45_Singatron_2TJ1610-005111F) Inside RJ45 Jack; 1CT:1CT; J8; D-; 0.1uF X4; J7; D+; J6; B-; J5; C-; J4; C+; UTP Side; J3; B+; J2; A-; J1; A+; 1000pF; 4x75 ohms; 2KV; Shield; Y; Inside Drawing need to be updated.; Yellow LED; Green LED; G
- (in symbol RTL8211FD_QFN40) RGMII I/O; 2.5 V (3.3 V tolerant); OD

### Library data of the parts
C65 = CAP_0201_1.0uF: CAP CER 1UF 6.3V 20% X5R 0201; MPN: C0603X5R0J105M030BC; QCI MPN: GRM033R60J105M; QPN: CH5101M9E02; QPN Description: CAP CHIP 1UF 6.3V(+-20%,X5R,0201); Function Code: LAN; Supplier 1: Digi-Key; Supplier Part Number 1: 445-8008-1-ND; QCI Supplier: MUR
C66 C68 C71 C73 C76-C79 C133 = CAP_0201_0.1uF: CAP CER 0.1UF 10V 10% X5R 0201; MPN: C0603X5R1A104K030BC; QCI MPN: GRM033R61A104K; QPN: CH4102K9E00; QPN Description: CAP CHIP 0.1U 10V(+-10%,X5R,0201); Function Code: LAN; Supplier 1: Digi-Key; Supplier Part Number 1: 445-7318-1-ND; QCI Supplier: MUR
C70 = CAP_0402_10uF: as C141 on sheet 05_AUDIO; Supplier 1: Digi-Key; Supplier Part Number 1: 1276-1450-1-ND; QCI Supplier: MUR
C72 = CAP_0402_4.7uF: CAP CER 4.7UF 10V 20% X5R 0402; MPN: C1005X5R1A475M050BC; QCI MPN: GRM155R61A475M; QPN: CH5472M9B01; QPN Description: CAP CHIP 4.7U 10V(+-20%,X5R,0402); Function Code: LAN; Supplier 1: Digi-Key; Supplier Part Number 1: 445-8023-1-ND; QCI Supplier: MUR
C74 C138 = CAP_0603_22uF: CAP CER 22UF 6.3V 10% X5R 0603; MPN: CL10A226KQ8NRNE; QCI MPN: GRM188R61A226M; QPN: CH6222M9901; QPN Description: CAP CHIP 22UF 10V(+-20%,X5R,0603); Function Code: USB; Supplier 1: Digi-Key; Supplier Part Number 1: 1276-2867-2-ND; QCI Supplier: MUR
C75 = CAP_0201_0.1uF: CAP CER 0.1UF 10V 10% X5R 0201; MPN: C0603X5R1A104K030BC; QCI MPN: GRM033R61A104K; QPN: CH4102K9E00; QPN Description: CAP CHIP 0.1U 10V(+-10%,X5R,0201); Function Code: SDC; Supplier 1: Digi-Key; Supplier Part Number 1: 445-7318-1-ND; QCI Supplier: MUR
C80 C81 = CAP_0201_22pF: CAP CER 22pF 6.3V 2% C0G NP0 0201; MPN: GJM0335C0J220GB01D; QCI MPN: GRM0335C1H220G; QPN: CH0226G0E00; QPN Description: CAP CHIP 22PF 50V(+-2%,COG,0201); Function Code: LAN; Supplier 1: Digi-Key; Supplier Part Number 1: 490-6067-2-ND; QCI Supplier: MUR
C82 = CAP_1206_1000pF_2KV: CAP CER 1000PF 2KV 10% 1206 X7R; MPN: CC1206KKX7RDBB102; QPN: CH2100IK212; QPN Description: CAP CHIP 1000P 2KV(+-10%,X7R,1206); Function Code: LAN; Supplier 1: Digi-Key; Supplier Part Number 1: 311-1487-1-ND; QCI MPN: CC1206KKX7RDBB102; QCI Supplier: YGO
C134 = CAP_0201_0.1uF: CAP CHIP 0.01UF 25V(+-10%,X7R,0201); MPN: GRM033R71E103K; QPN: CH3104K1E01; Function Code: LAN; Supplier 1: Digi-Key; Supplier Part Number 1: 445-7318-1-ND; QCI MPN: GRM033R71E103K; QCI Supplier: MUR; QPN Description: CAP CHIP 0.01UF 25V(+-10%,X7R,0201)
C147 = CAP_0201_47pF: CAP CER 47PF 25V 0201; MPN: GRM0335C1E470FA01D; QCI MPN: GRM0335C1E470J; QPN: CH0474J0E09; QPN Description: CAP CHIP 47P 25V(+-5%,COG,0201); Function Code: LCD; Supplier 1: Digi-Key; Supplier Part Number 1: 490-11298-1-ND; QCI Supplier: MUR
C148-C150 = CAP_0201_1.0nF: CAP CHIP 680PF 25V(+-10%,X7R,0201); MPN: GRM033R71E681K; QPN: CH1684K1E00; Function Code: SPK; Supplier 1: Digi-Key; QCI MPN: GRM033R71E681K; QCI Supplier: MUR; QPN Description: CAP CHIP 680PF 25V(+-10%,X7R,0201)
D2-D4 D6 D7 D10 = Diode-ESDALC6V1-1U2: TVS DIODE 3V ST0201; MPN: DESD5V0V1BCSP-7; Function Code: SDC; QPN: BC5V0V1BZ02; QPN Description: DIODE ESD SMD DESD5V0V1BCSP-7 6V,DSN0603; DNP: V; Supplier 1: Digi-Key; Supplier Part Number 1: 497-8752-1-ND; QCI Supplier: DDS; QCI MPN: DESD5V0V1BCSP-7
ESD14 ESD23 = DIODE BI-DIR TRIG: DIODE TVS 15kV 10V 50A 8pF SMT RoHS; MPN: DESD5V0V1BCSP-7; QPN: BC5V0V1BZ02; QPN Description: DIODE ESD SMD DESD5V0V1BCSP-7 6V,DSN0603; Function Code: SDC; DNP: V; QCI MPN: DESD5V0V1BCSP-7; QCI Supplier: DDS
FB1 = INDUCTOR_BLM18EG221SN1D: FERRITE CHIP 220 OHM 2.0A 0603; QPN: CX8EG221011; QPN Description: EMI FILTER BLM18EG221SN1D(220,2A); Function Code: LAN; Supplier 1: Digi-Key; Supplier Part Number 1: 490-3992-1-ND; QCI Supplier: MUR; MPN: BLM18EG221SN1D; QCI MPN: BLM18EG221SN1D
J8 = CONN_MICRO_SDCARD_8P_ALPS: CON SD CARD PUSH SMT 1.32mm 8pin; QPN: DFHS08FR182; QPN Description: CONN SMD MICRO SD CARD 8P FR(H1.45); Function Code: SDC; Supplier 1: Mouser; Supplier Part Number 1: SCHA4B0419; MPN: SCHA4B0419; QCI MPN: SCHA4B0419; QCI Supplier: ALP
J11 = RJ45_Singatron_2TJ1610-005111F: CON 10 RJ45 SKT RA TH WITH G/Y LEDS 50MIL SP 611H -- 120L; Function Code: LAN; QPN: DFTJ14FR067; QPN Description: CONNDIP RJ45 14P2R FR(P2.54,H13.8)G/YLED; MPN: 2TJ1610-005111F; QCI MPN: 2TJ1610-005111F; QCI Supplier: SIT
L1 L5-L7 = IND_CMC_DLW21: EMI FLTR DLP0NSN121HL2L(120,20%,90MA); QPN: CX121HL2000; Function Code: LAN; Supplier 1: Digi-Key; MPN: DLP0NSN121HL2L; QCI MPN: DLP0NSN121HL2L; QCI Supplier: MUR; QPN Description: EMI FLTR DLP0NSN121HL2L(120,20%,90MA)
R52 R60 R173 = R_0201_0: RES SMD 0.0OHM JUMPER 1/20W 0201; MPN: ERJ-1GN0R00C; QCI MPN: RC0201JR-130RL; DNP: V; QPN: CS00001JE18; QPN Description: RES CHIP 0(1/20W,+-5%,0201); Function Code: LAN; Supplier 1: Digi-Key; Supplier Part Number 1: P15979CT-ND; VALUE: 0R_DNP; QCI Supplier: YGO
R53 R65-R67 R71 R141 = R_0201_0: RES SMD 0.0OHM JUMPER 1/20W 0201; MPN: ERJ-1GN0R00C; QCI MPN: RC0201JR-130RL; QPN: CS00001JE18; QPN Description: RES CHIP 0(1/20W,+-5%,0201); Function Code: LAN; Supplier 1: Digi-Key; Supplier Part Number 1: P15979CT-ND; VALUE: 0R; QCI Supplier: YGO
R54 = R_0201_10K: RES SMD 10K OHM JUMPER 1/20W  0201; MPN: ERJ-1GEF103C; QCI MPN: RC0201JR-1310KL; QPN: CS31001JE16; QPN Description: RES CHIP 10K 1/20W +-5%(0201); Function Code: SDC; Supplier 1: Digi-Key; Supplier Part Number 1: P10.0KABCT-ND; QCI Supplier: YGO
R55-R59 R160 = R_0201_0: RES SMD 0.0OHM JUMPER 1/20W 0201; MPN: ERJ-1GN0R00C; QCI MPN: RC0201JR-130RL; QPN: CS00001JE18; QPN Description: RES CHIP 0(1/20W,+-5%,0201); Function Code: SDC; Supplier 1: Digi-Key; Supplier Part Number 1: P15979CT-ND; VALUE: 0R; QCI Supplier: YGO
R61 R62 R75 R77 R78 R81-R83 R85 R86 R178 = R_0201_4.7K: RES SMD 4.7K OHM 1% 1/20W 0201; MPN: ERJ-1GEF4701C; QCI MPN: RC0201FR-134K7L; QPN: CS24701FE00; QPN Description: RES CHIP 4.7K 1/20W +-1%(0201; Function Code: LAN; Supplier 1: Digi-Key; Supplier Part Number 1: P4.70KABCT-ND; QCI Supplier: YGO
  R61 R62 R75 R77 R78 R81-R83 R178: VALUE: 4.7K
R63 R64 = R_0201_1.5K: RES SMD 1.5K OHM JUMPER 1/20W  0201; MPN: ERJ-1GEJ6152C; QCI MPN: RC0201FR-071K5L; QPN: CS21501FE01; QPN Description: RES CHIP 1.5K 1/20W +-1%(0201); Function Code: LAN; Supplier 1: Digi-Key; VALUE: 1.5K; Supplier Part Number 1: P1.5KAGCT-ND; QCI Supplier: YGO
R70 = R_0201_2.49K: RES SMD 2.49K OHM 1% 1/20W 0201; MPN: RC0201FR-132K49L; QCI MPN: RM02FTN2491; QPN: CS22491FE02; QPN Description: RES CHIP 2.49K(1/20W,+-1%,0201); Function Code: LAN; Supplier 1: Digi-Key; VALUE: 2.49K/1%; Supplier Part Number 1: P2.49KABCT-ND; QCI Supplier: TAI
R74 = R_0201_4.7K: RES SMD 4.7K OHM 1% 1/20W 0201; MPN: ERJ-1GEF4701C; QCI MPN: RC0201FR-134K7L; DNP: V; QPN: CS24701FE00; QPN Description: RES CHIP 4.7K 1/20W +-1%(0201; Function Code: SDC; Supplier 1: Digi-Key; Supplier Part Number 1: P4.70KABCT-ND; VALUE: 4.7K_DNP; QCI Supplier: YGO
R76 R80 = R_0201_300: RES CHIP 470 1/20W +-5% (0201); MPN: RC0201JR-07470RL; QPN: CS14701JE00; Function Code: LAN; Supplier 1: Digi-Key; VALUE: 470R; Supplier Part Number 1: P300ABCT-ND; QCI MPN: RC0201JR-07470RL; QCI Supplier: YGO; QPN Description: RES CHIP 470 1/20W +-5%(0201)
R79 R140 R177 = R_0201_4.7K: RES SMD 4.7K OHM 1% 1/20W 0201; MPN: ERJ-1GEF4701C; QCI MPN: RC0201FR-134K7L; DNP: V; QPN: CS24701FE00; QPN Description: RES CHIP 4.7K 1/20W +-1%(0201; Function Code: LAN; Supplier 1: Digi-Key; Supplier Part Number 1: P4.70KABCT-ND; QCI Supplier: YGO
  R79: VALUE: 4.7K_DNP
R84 R193 R194 = R_0805_0: RES SMD 0 OHM 1% 1/2W 0805; Supplier Part Number 1: 541-0.0TBCT-ND; Supplier 1: Digi-Key
R97 = R_0201_0: RES SMD 0.0OHM JUMPER 1/20W 0201; MPN: ERJ-1GN0R00C; QCI MPN: RC0201JR-130RL; DNP: V; QPN: CS00001JE18; QPN Description: RES CHIP 0(1/20W,+-5%,0201); Function Code: SDC; Supplier 1: Digi-Key; Supplier Part Number 1: P15979CT-ND; QCI Supplier: YGO
TP47 TP71-TP79 = TP: TEST POIN
U18 = RTL8211FD_QFN40: IC XCVR ETHERNET PHY 10/100/1000G-BIT 3.3V QFN40; QCI MPN: RTL8211FD-CG; QPN: AL008211014; QPN Description: IC CTRL(40P)RTL8211FD-CG(QFN); Function Code: LAN; Supplier 1: Arrow; MPN: RTL8211FD_QFN40; QCI Supplier: RSC
Y2 = XTAL_25MHZ_ABM10AIG-25.000MHZ-4Z-T3: Crystal 25.0000MHz 30ppm 10pF 60 Ohm -40蚓 - 125蚓 Surface Mount 4-SMD, No Lead (DFN, LCC); Function Code: LAN; QPN: BG6250000B5; QPN Description: XTAL SMD 25MHZ(+-10PPM,16PF)8Y25000014; Supplier 1: Digi-Key; Supplier Part Number 1: 535-13365-1-ND; MPN: 8Y25000014; QCI MPN: 8Y25000014; QCI Supplier: TXC